# EAGLE schematic Krets_1 (EAGLE 9.3.0)
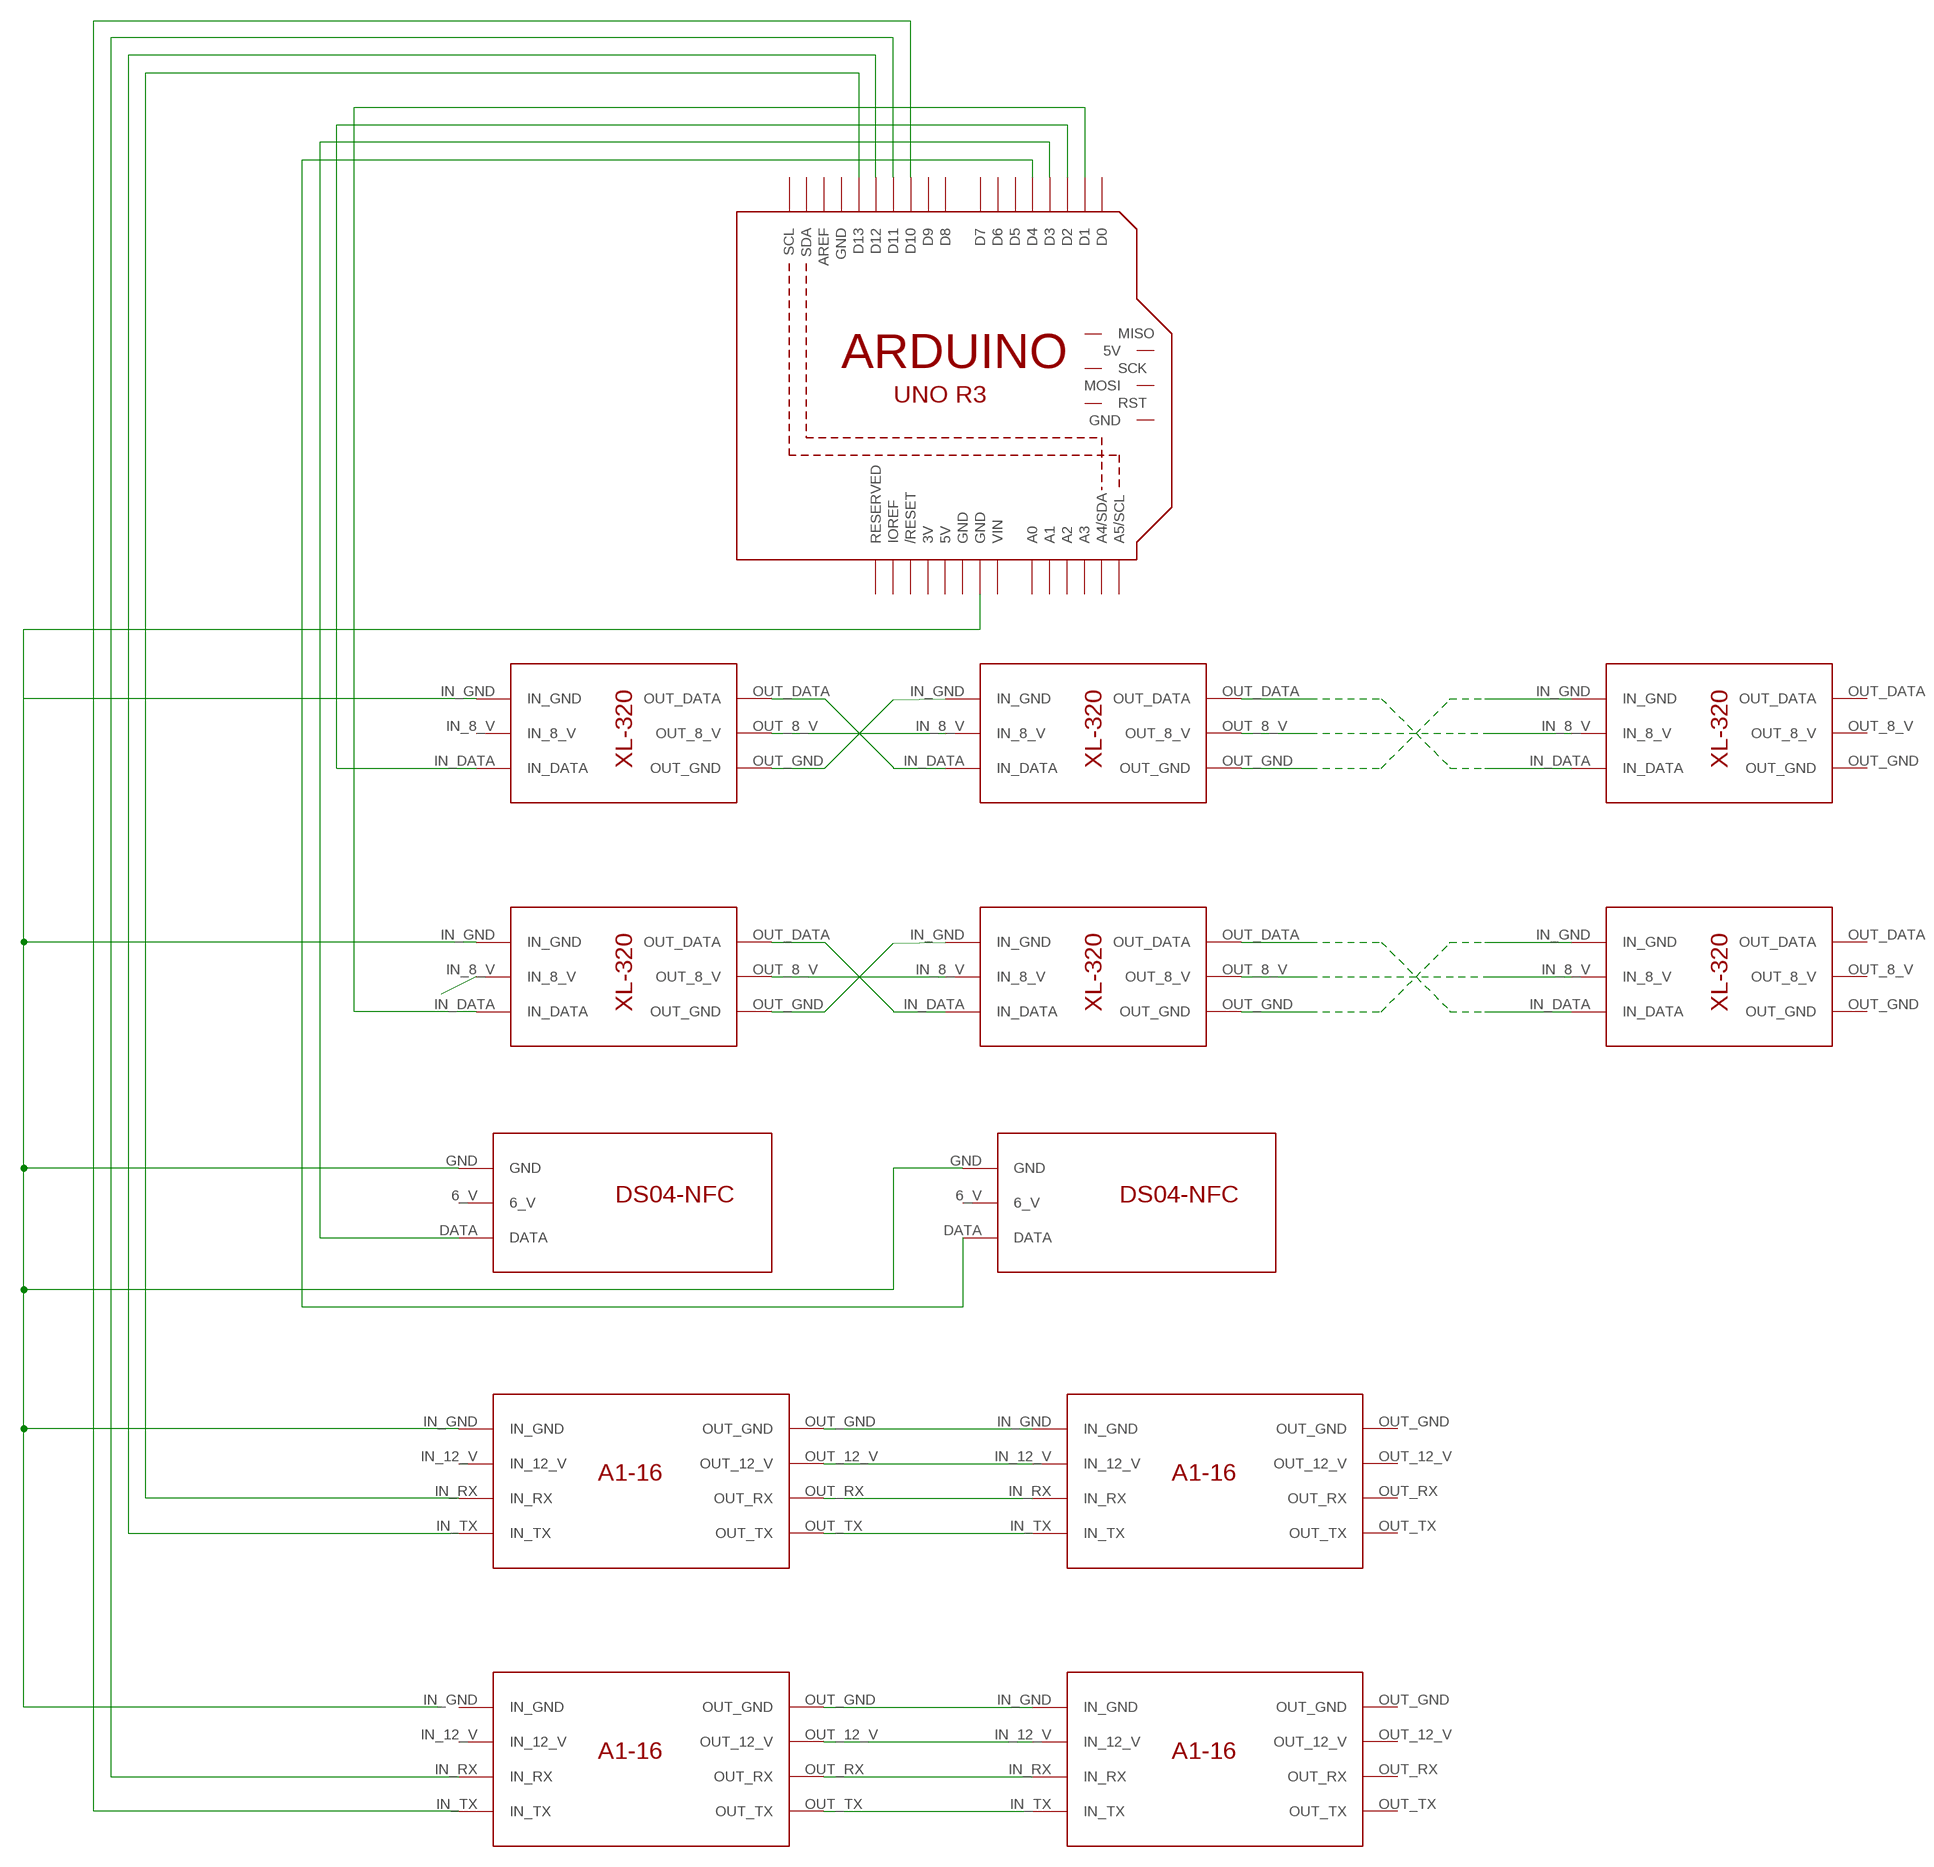
[diagram p0: schematic, sheet 1]

## Parts
M1  ARDUINO_R3_ICSP  [ARDUINOR3_ICSP]
U$1  XL-320  [XL-320]
U$2  XL-320  [XL-320]
U$3  XL-320  [XL-320]
U$4  DS04-NFCEXTRA_MOTOR  [DS04-NFC]
U$5  DS04-NFCEXTRA_MOTOR  [DS04-NFC]
U$6  A1-16  [A1-16]
U$7  A1-16  [A1-16]
U$8  A1-16  [A1-16]
U$9  A1-16  [A1-16]
U$10  XL-320  [XL-320]
U$11  XL-320  [XL-320]
U$12  XL-320  [XL-320]

## Nets
N$1: U$1.OUT_GND U$2.IN_GND
N$2: U$1.OUT_8_V U$2.IN_8_V
N$3: U$1.OUT_DATA U$2.IN_DATA
N$4: U$2.OUT_GND U$3.IN_GND
N$5: U$2.OUT_8_V U$3.IN_8_V
N$6: U$2.OUT_DATA U$3.IN_DATA
N$7: M1.D1 U$1.IN_DATA
N$8: M1.D2 U$10.IN_DATA
N$9: M1.D4 U$5.DATA
N$10: U$6.OUT_TX U$7.IN_TX
N$11: U$6.OUT_RX U$7.IN_RX
N$12: U$6.OUT_12_V U$7.IN_12_V
N$13: U$6.OUT_GND U$7.IN_GND
N$14: U$8.OUT_GND U$9.IN_GND
N$15: U$8.OUT_12_V U$9.IN_12_V
N$16: U$8.OUT_RX U$9.IN_RX
N$17: U$8.OUT_TX U$9.IN_TX
N$18: M1.GND@3(GND) U$1.IN_GND U$4.GND U$5.GND U$6.IN_GND
N$19: U$10.OUT_GND U$11.IN_GND
N$20: M1.D10 U$8.IN_TX
N$21: M1.D11 U$8.IN_RX
N$22: M1.D12 U$6.IN_TX
N$23: M1.D13 U$6.IN_RX
N$24: U$10.OUT_8_V U$11.IN_8_V
N$25: U$10.OUT_DATA U$11.IN_DATA
N$26: U$11.OUT_GND U$12.IN_GND
N$27: U$11.OUT_8_V U$12.IN_8_V
N$28: U$11.OUT_DATA U$12.IN_DATA
N$29: M1.D3 U$4.DATA
N$30: U$10.IN_GND
N$31: U$1.IN_8_V
Unconnected: M1.5V_ICSP(5V) M1.A0 M1.A1 M1.A2 M1.A3 M1.A4(A4/SDA) M1.A5(A5/SCL) M1.AREF M1.D0 M1.D5 M1.D6 M1.D7 M1.D8 M1.D9 M1.GND@2(GND) M1.IOREF M1.MISO M1.MOSI M1.RESERVED M1.RESET(/RESET) M1.RESET_ICSP(RST) M1.SCK M1.SCL M1.SDA U$3.OUT_8_V U$3.OUT_DATA U$3.OUT_GND U$4.6_V U$5.6_V U$6.IN_12_V U$7.OUT_12_V U$7.OUT_GND U$7.OUT_RX U$7.OUT_TX U$8.IN_12_V U$8.IN_GND U$9.OUT_12_V U$9.OUT_GND U$9.OUT_RX U$9.OUT_TX U$10.IN_8_V U$12.OUT_8_V U$12.OUT_DATA U$12.OUT_GND

## Power pins joined to a net without a drawn wire
3V: M1.3V
5V: M1.5V
GND: M1.GND M1.GND@1(GND)
VIN: M1.VIN

## Library data of the parts
M1 = adafruit:ARDUINO_R3_ICSP
U$1-U$3 U$10-U$12 = Externa_motorer:XL-320
U$4 U$5 = Externa_motorer:DS04-NFC
U$6-U$9 = Externa_motorer:A1-16